# Altium schematic sheet Power_Over_Ethernet.SchDoc: Power over Ethernet
size A3; Organization: Reichle & De-Massari; Address1: Binzstrasse 32; Address2: 8620 Wetzikon; Address3: Switzerland; DocumentNumber: 4; Revision: V0.1; SheetNumber: 4; SheetTotal: 11
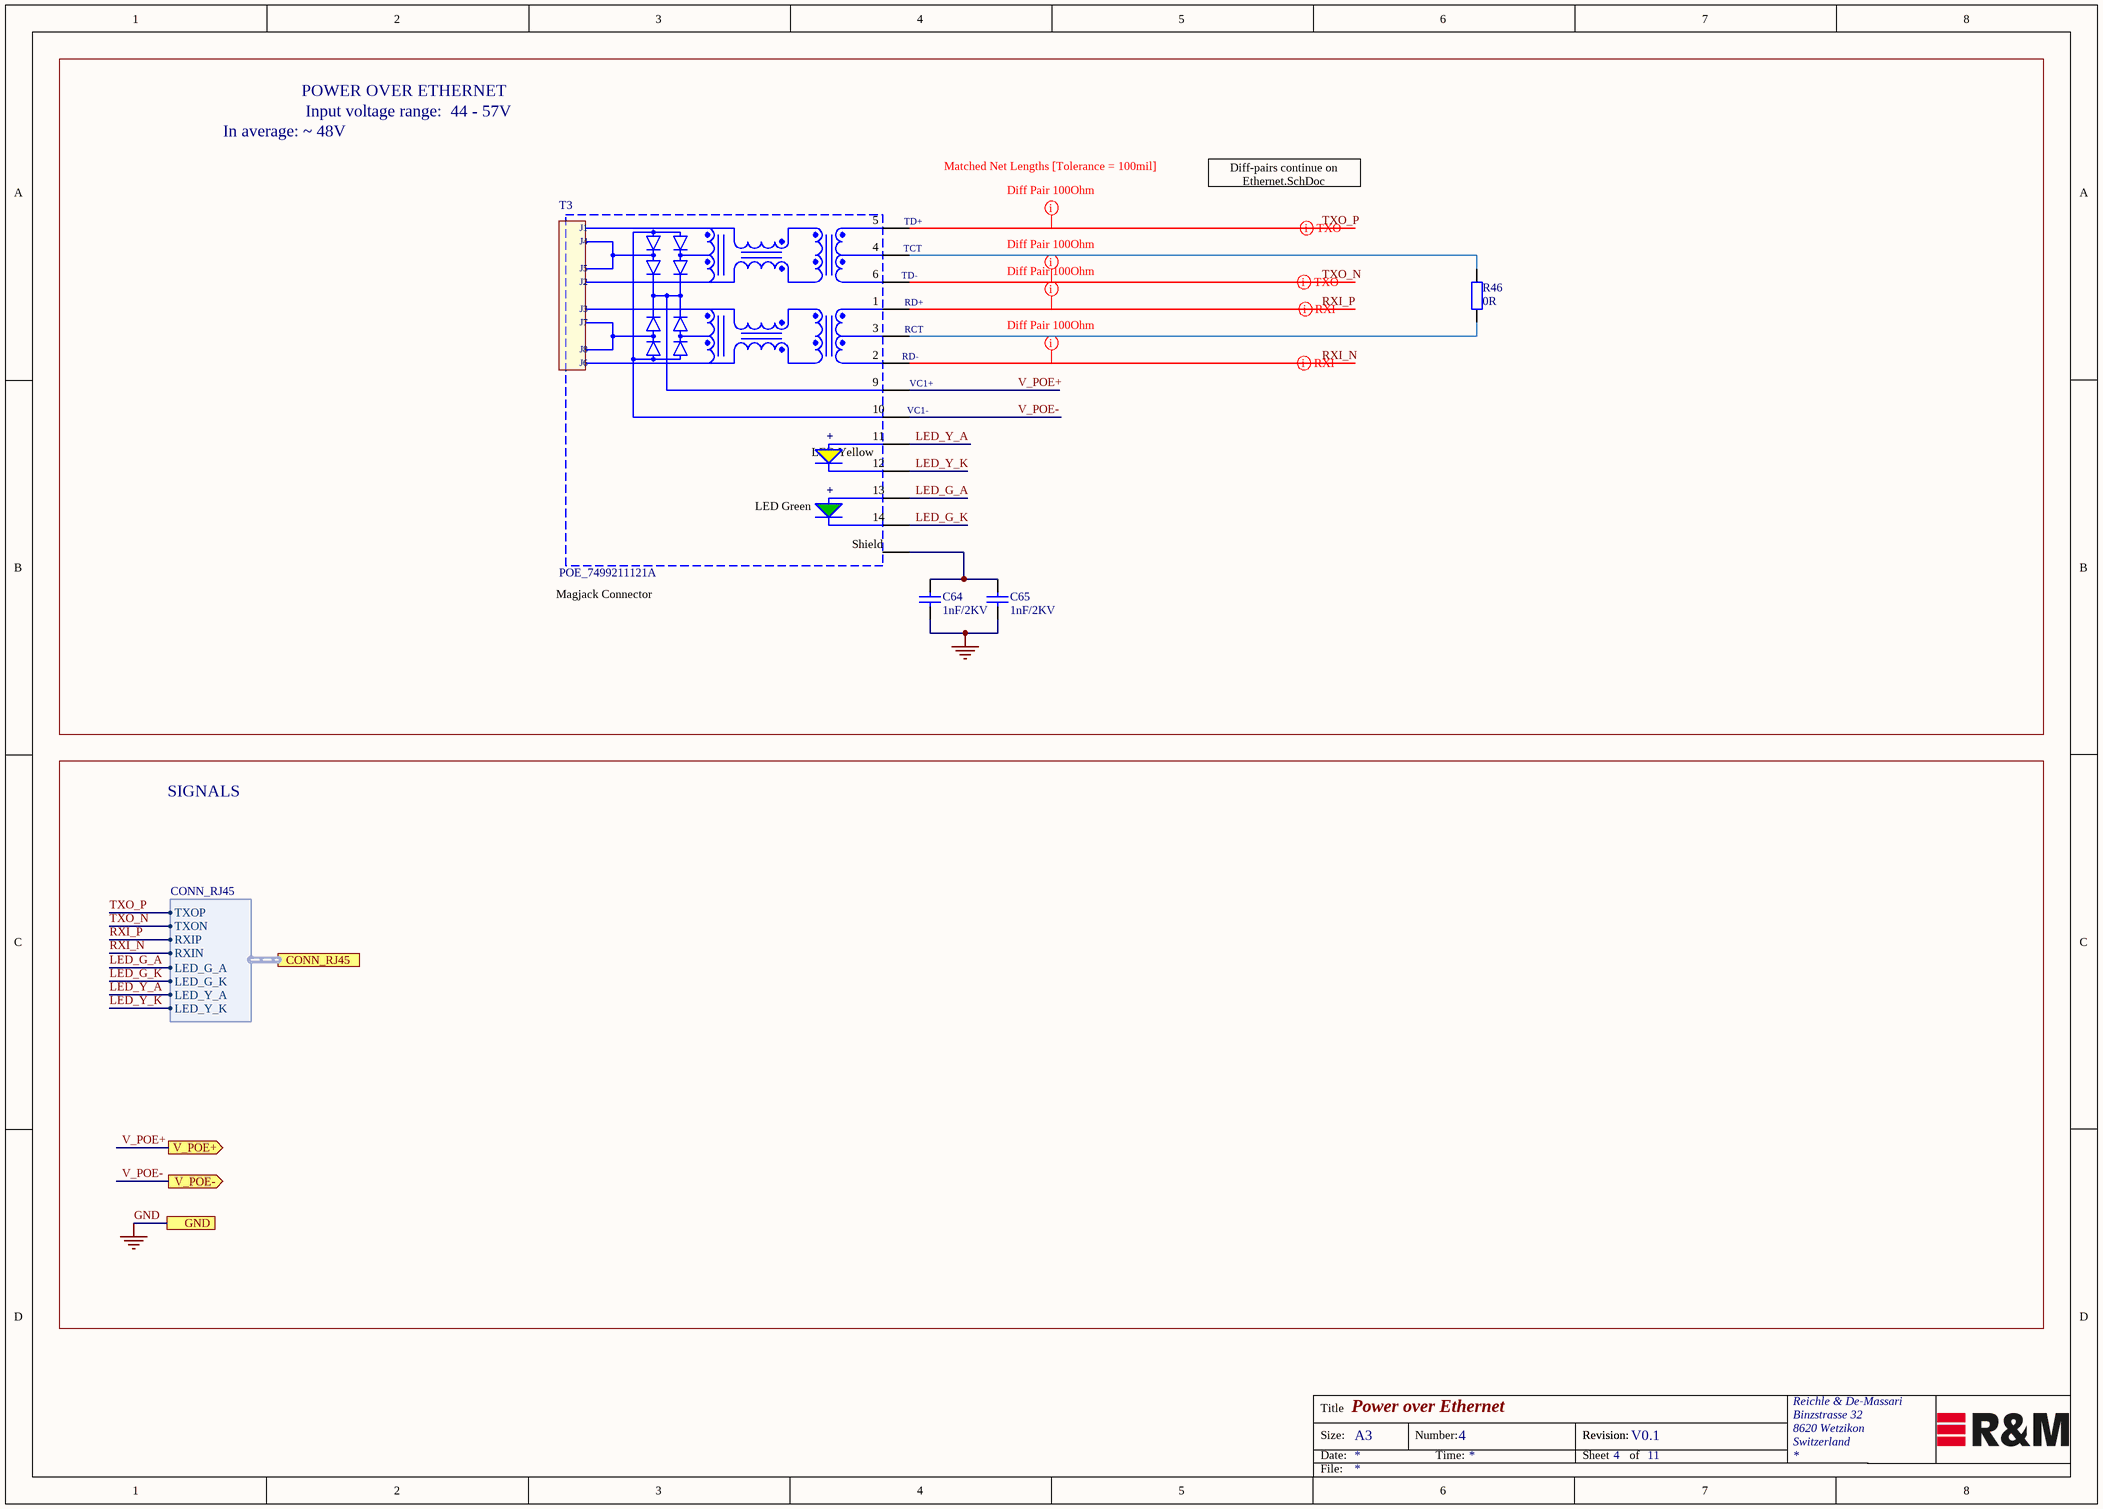
[diagram p0: Power_Over_Ethernet.SchDoc]

## Parts
C64  1nF/2KV  [Ceramic Capacitor 1206 EIA]
C65  1nF/2KV  [Ceramic Capacitor 1206 EIA]
R46  0R  [Resistor 0805 EIA]
T3  POE_7499211121A  [PoE_7499211121A]

## Ports
CONN_RJ45 (harness CONN_RJ45), GND, V_POE+ (out), V_POE- (out)

## Harnesses
CONN_RJ45: TXOP, TXON, RXIP, RXIN, LED_G_A, LED_G_K, LED_Y_A, LED_Y_K

## Nets
GND: C64.1 C65.1 ; port GND
LED_G_A: T3.13 ; port CONN_RJ45.LED_G_A
LED_G_K: T3.14 ; port CONN_RJ45.LED_G_K
LED_Y_A: T3.11 ; port CONN_RJ45.LED_Y_A
LED_Y_K: T3.12 ; port CONN_RJ45.LED_Y_K
RXI_N: T3.2(RD-) ; port CONN_RJ45.RXIN
RXI_P: T3.1(RD+) ; port CONN_RJ45.RXIP
TXO_N: T3.6(TD-) ; port CONN_RJ45.TXON
TXO_P: T3.5(TD+) ; port CONN_RJ45.TXOP
V_POE+: T3.9(VC1+) ; port V_POE+
V_POE-: T3.10(VC1-) ; port V_POE-
NetC64_2: C64.2 C65.2 T3.Shield
NetR46_1: R46.1 T3.4(TCT)
NetR46_2: R46.2 T3.3(RCT)

## Layout directives
mark named Diff Pair 100Ohm: RXI_N, RXI_P, TXO_N, TXO_P
differential pair: RXI_N, RXI_P, TXO_N, TXO_P

## Notes on the sheet
- POWER OVER ETHERNET
- In average: ~ 48V
- Input voltage range:  44 - 57V
- Matched Net Lengths [Tolerance = 100mil]
- Diff-pairs continue on Ethernet.SchDoc
- Magjack Connector
- SIGNALS
- Title
- Size:
- Date:
- A3
- Number:
- Time:
- Revision:
- Sheet
- of
- File:
- (in symbol CONN_RJ45_PoE) J1; J4; J5; J2; J3; J7; J8; J6; +; LED Yellow; LED Green

## Library data of the parts
C64 C65 = Cap_1nF_1206_2000V: 1000pF ±10% 2000V (2kV) Ceramic Capacitor X7R 1206 (3216 Metric); Manufacturer: AVX Corporation; Manufacturer PartNr: 1206GC102KAZ1A; Replaceable: yes; value: 1nF/2KV; tolerance: ±10%; voltage: 2kV; Dielectric Grade: X7R; Footprint/Package: 1206 (3216 Metric); Supplier 1: Digi-Key; Supplier Part Number 1: 478-4600-1-ND
R46 = Res_0R_0805: 0 Ohms Jumper 0.125W, 1/8W Chip Resistor 0805 (2012 Metric) Automotive AEC-Q200 Thick Film; Manufacturer: Panasonic Electronic Components; Manufacturer PartNr: ERJ-6GEY0R00V; Replaceable: yes; value: 0R; tolerance: -; power: 0.125W, 1/8W; Footprint/Package: 0805 (2012 metric); Supplier 1: Digi-Key; Supplier Part Number 1: P0.0ACT-ND
T3 = CONN_RJ45_PoE: Magjack Connector WE-RJ45 (PoE) with LAN Transformer, 10/100 Base-T1 Port RJ45, 10/100 Base-T, AutoMDIX, two LEDs; power: PoE (up to 350 mA); Replaceable: no; tolerance: NA; Manaufacturer: Wurth Elektronik; ComponentLink1Description: Manufacturer; ComponentLink1URL: http://www.we-online.de; ComponentLink2Description: Datasheet; ComponentLink2URL: http://katalog.we-online.de/pbs/datasheet/7499211121A.pdf; Manufacturer PartNr: 7499211121A; Supplier 1: Digi-Key; Supplier Part Number 1: 732-1654-ND; value: POE_7499211121A; DIelectric Grade: NA; voltage: NA